# EAGLE design washing-machine (EAGLE 7.7.0)
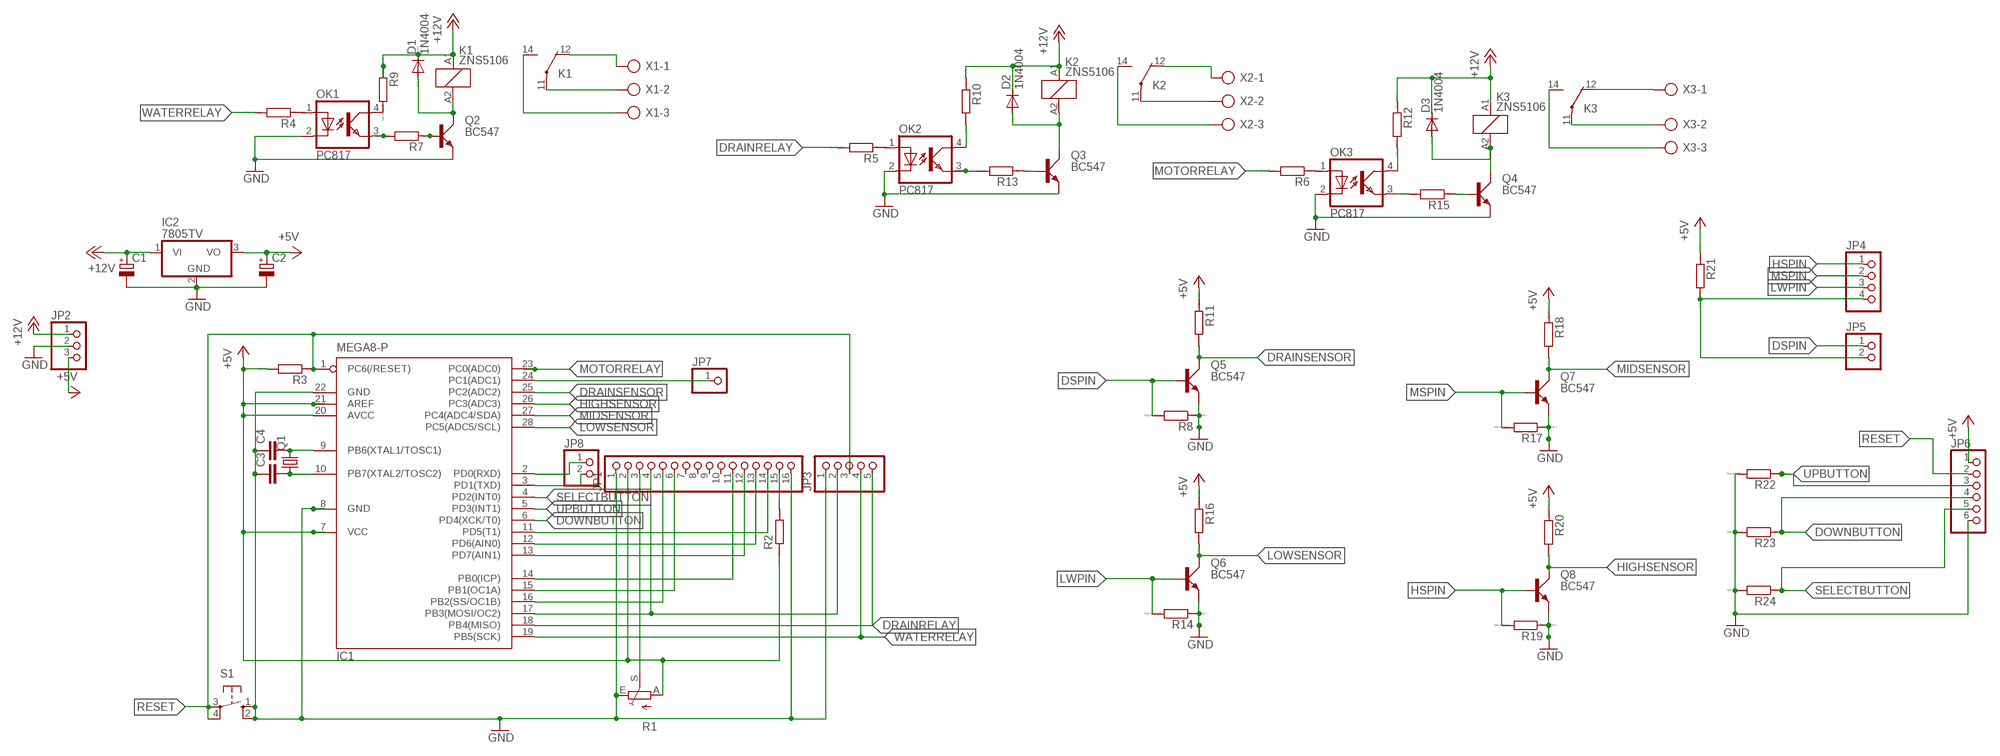
[diagram p0: schematic, sheet 1]

## Parts
C1  CPOL-EUE1.8-4  [E1,8-4]
C2  CPOL-EUE1.8-4  [E1,8-4]
C3  C-EU025-024X044  [C025-024X044]
C4  C-EU025-024X044  [C025-024X044]
D1  1N4004  [DO41-10]
D2  1N4004  [DO41-10]
D3  1N4004  [DO41-10]
IC1  MEGA8-P  [DIL28-3]
IC2  7805TV  [TO220V]
JP1  PINHD-1X16  [1X16]
JP2  PINHD-1X3  [1X03]
JP3  PINHD-1X5  [1X05]
JP4  PINHD-1X4  [1X04]
JP5  PINHD-1X2  [1X02]
JP6  PINHD-1X6  [1X06]
JP7  PINHD-1X1  [1X01]
JP8  PINHD-1X2  [1X02]
K1  ZNS5106  [ZN5]
K2  ZNS5106  [ZN5]
K3  ZNS5106  [ZN5]
OK1  PC817  [DIL04]
OK2  PC817  [DIL04]
OK3  PC817  [DIL04]
Q1  CRYSTALHC49S  [HC49/S]
Q2  BC547  [SOT54A]
Q3  BC547  [SOT54A]
Q4  BC547  [SOT54A]
Q5  BC547  [SOT54A]
Q6  BC547  [SOT54A]
Q7  BC547  [SOT54A]
Q8  BC547  [SOT54A]
R1  TRIM_EU-S63P  [S63P]
R2  R0204/7  [0204/7]
R3  R0204/7  [0204/7]
R4  R0204/7  [0204/7]
R5  R0204/7  [0204/7]
R6  R0204/7  [0204/7]
R7  R0204/7  [0204/7]
R8  R0204/7  [0204/7]
R9  R0204/7  [0204/7]
R10  R0204/7  [0204/7]
R11  R0204/7  [0204/7]
R12  R0204/7  [0204/7]
R13  R0204/7  [0204/7]
R14  R0204/7  [0204/7]
R15  R0204/7  [0204/7]
R16  R0204/7  [0204/7]
R17  R0204/7  [0204/7]
R18  R0204/7  [0204/7]
R19  R0204/7  [0204/7]
R20  R0204/7  [0204/7]
R21  R0204/7  [0204/7]
R22  R0204/7  [0204/7]
R23  R0204/7  [0204/7]
R24  R0204/7  [0204/7]
S1  10-XX  [B3F-10XX]
X1  AK500/3  [AK500/3]
X2  AK500/3  [AK500/3]
X3  AK500/3  [AK500/3]

## Nets
+5V: C2.+ IC1.7(VCC) IC1.20(AVCC) IC1.21(AREF) IC2.3(VO) JP1.2 JP2.3 JP6.1 R1.A R2.1 R3.2 R11.1 R16.1 R18.1 R20.1 R21.1
+12V: C1.+ D1.C D2.C D3.C IC2.1(VI) JP2.1 K1.A1 K2.A1 K3.A1 R9.1 R10.1 R12.1
DOWNBUTTON: IC1.6(PD4(XCK/T0)) JP6.4 R23.1
DRAINRELAY: IC1.18(PB4(MISO)) JP3.5 R5.2
DRAINSENSOR: IC1.25(PC2(ADC2)) Q5.C R11.2
DSPIN: JP5.1 Q5.B R8.2
GND: C1.- C2.- C3.1 C4.1 IC1.8(GND) IC1.22(GND) IC2.2(GND) JP1.1 JP1.16 JP2.2 JP3.1 JP6.6 OK1.2(C) OK2.2(C) OK3.2(C) Q2.E Q3.E Q4.E Q5.E Q6.E Q7.E Q8.E R1.E R8.1 R14.1 R17.1 R19.1 R22.2 R23.2 R24.2 S1.1(S) S1.2(S1)
HIGHSENSOR: IC1.26(PC3(ADC3)) Q8.C R20.2
HSPIN: JP4.1 Q8.B R19.2
LOWSENSOR: IC1.28(PC5(ADC5/SCL)) Q6.C R16.2
LWPIN: JP4.3 Q6.B R14.2
MIDSENSOR: IC1.27(PC4(ADC4/SDA)) Q7.C R18.2
MOTORRELAY: IC1.23(PC0(ADC0)) R6.2
MSPIN: JP4.2 Q7.B R17.2
N$1: IC1.13(PD7(AIN1)) JP1.12
N$2: IC1.11(PD5(T1)) JP1.14
N$3: IC1.12(PD6(AIN0)) JP1.13
N$4: IC1.17(PB3(MOSI/OC2)) JP1.4 JP3.2
N$5: IC1.16(PB2(SS/OC1B)) JP1.5
N$6: IC1.15(PB1(OC1A)) JP1.6
N$7: IC1.14(PB0(ICP)) JP1.11
N$8: C3.2 IC1.10(PB7(XTAL2/TOSC2)) Q1.1
N$9: C4.2 IC1.9(PB6(XTAL1/TOSC1)) Q1.2
N$10: OK1.1(A) R4.1
N$11: JP1.3 R1.S
N$12: OK1.3(EMIT) R7.2
N$13: Q2.B R7.1
N$14: OK2.4(COL) R10.2
N$15: D1.A K1.A2 Q2.C
N$16: D2.A K2.A2 Q3.C
N$17: OK1.4(COL) R9.2
N$18: OK2.3(EMIT) R13.2
N$19: Q3.B R13.1
N$20: OK3.4(COL) R12.2
N$21: OK3.3(EMIT) R15.2
N$22: Q4.B R15.1
N$23: D3.A K3.A2 Q4.C
N$24: K3.11(2:P) X3.2
N$25: K2.11(2:P) X2.2
N$26: K1.11(2:P) X1.2
N$27: K1.12(2:O) X1.1
N$28: JP1.15 R2.2
N$29: K1.14(2:S) X1.3
N$30: K2.12(2:O) X2.1
N$31: IC1.3(PD1(TXD)) JP8.2
N$32: OK2.1(A) R5.1
N$33: OK3.1(A) R6.1
N$34: K2.14(2:S) X2.3
N$35: K3.12(2:O) X3.1
N$36: K3.14(2:S) X3.3
N$37: JP4.4 JP5.2 R21.2
N$38: IC1.2(PD0(RXD)) JP8.1
N$39: IC1.24(PC1(ADC1)) JP7.1
RESET: IC1.1(PC6(/RESET)) JP3.3 JP6.2 R3.1 S1.3(P) S1.4(P1)
SELECTBUTTON: IC1.4(PD2(INT0)) JP6.5 R24.1
UPBUTTON: IC1.5(PD3(INT1)) JP6.3 R22.1
WATERRELAY: IC1.19(PB5(SCK)) JP3.4 R4.2
Unconnected: JP1.7 JP1.8 JP1.9 JP1.10

## Library data of the parts
C1 C2 = rcl:CPOL-EU: POLARIZED CAPACITOR, European symbol
C3 C4 = rcl:C-EU: CAPACITOR, European symbol
D1-D3 = diode:1N4004: DIODE general purpose rectifier, 1 A
IC1 = atmel:MEGA8-P: MICROCONTROLLER 8 Kbytes FLASH, 1 kbytes SRAM, 512 bytes EEPROM, USART, 4-channel 10 bit ADC, 2-channel 8 bit ADC Pin compatible with Atmega48, ATMega88, ATMega168 Source: avr.lbr; OC_FARNELL: unknown; OC_NEWARK: unknown
IC2 = linear:78*: Positive VOLTAGE REGULATOR Source: http://cache.national.com/ds/LM/LM78L05.pdf http://www.fairchildsemi.com/ds/LM/LM7805.pdf
JP1 = pinhead:PINHD-1X16: PIN HEADER
JP2 = pinhead:PINHD-1X3: PIN HEADER
JP3 = pinhead:PINHD-1X5: PIN HEADER
JP4 = pinhead:PINHD-1X4: PIN HEADER
JP5 JP8 = pinhead:PINHD-1X2: PIN HEADER
JP6 = pinhead:PINHD-1X6: PIN HEADER
JP7 = pinhead:PINHD-1X1: PIN HEADER
K1-K3 = relay:ZNS5*: Miniature Power PCB Relay SCHRACK 1pole 10 A Source: http://www.schrack.com/.. 5847.pdf; OC_FARNELL: unknown; OC_NEWARK: unknown
OK1-OK3 = optocoupler:PC817: SHARP OPTO COUPLER; MPN: PC817X4J000F; OC_FARNELL: 9707727; OC_NEWARK: 97K7059
Q1 = crystal:CRYSTAL: CRYSTAL; OC_FARNELL: 1667008; OC_NEWARK: unknown
Q2-Q8 = transistor-small-signal:BC547: NPN TRANSISTOR
R1 = pot:TRIM_EU-: POTENTIOMETER
R2-R24 = eagle-ltspice:R: RESISTOR, European symbol; SPICEMODEL: NONE; SPICEPREFIX: R
S1 = switch-omron:10-XX: OMRON SWITCH; MPN: B3F-1000; OC_FARNELL: 176432; OC_NEWARK: 36M3542
X1-X3 = con-ptr500:AK500/3: CONNECTOR; OC_FARNELL: unknown; OC_NEWARK: unknown

## Board
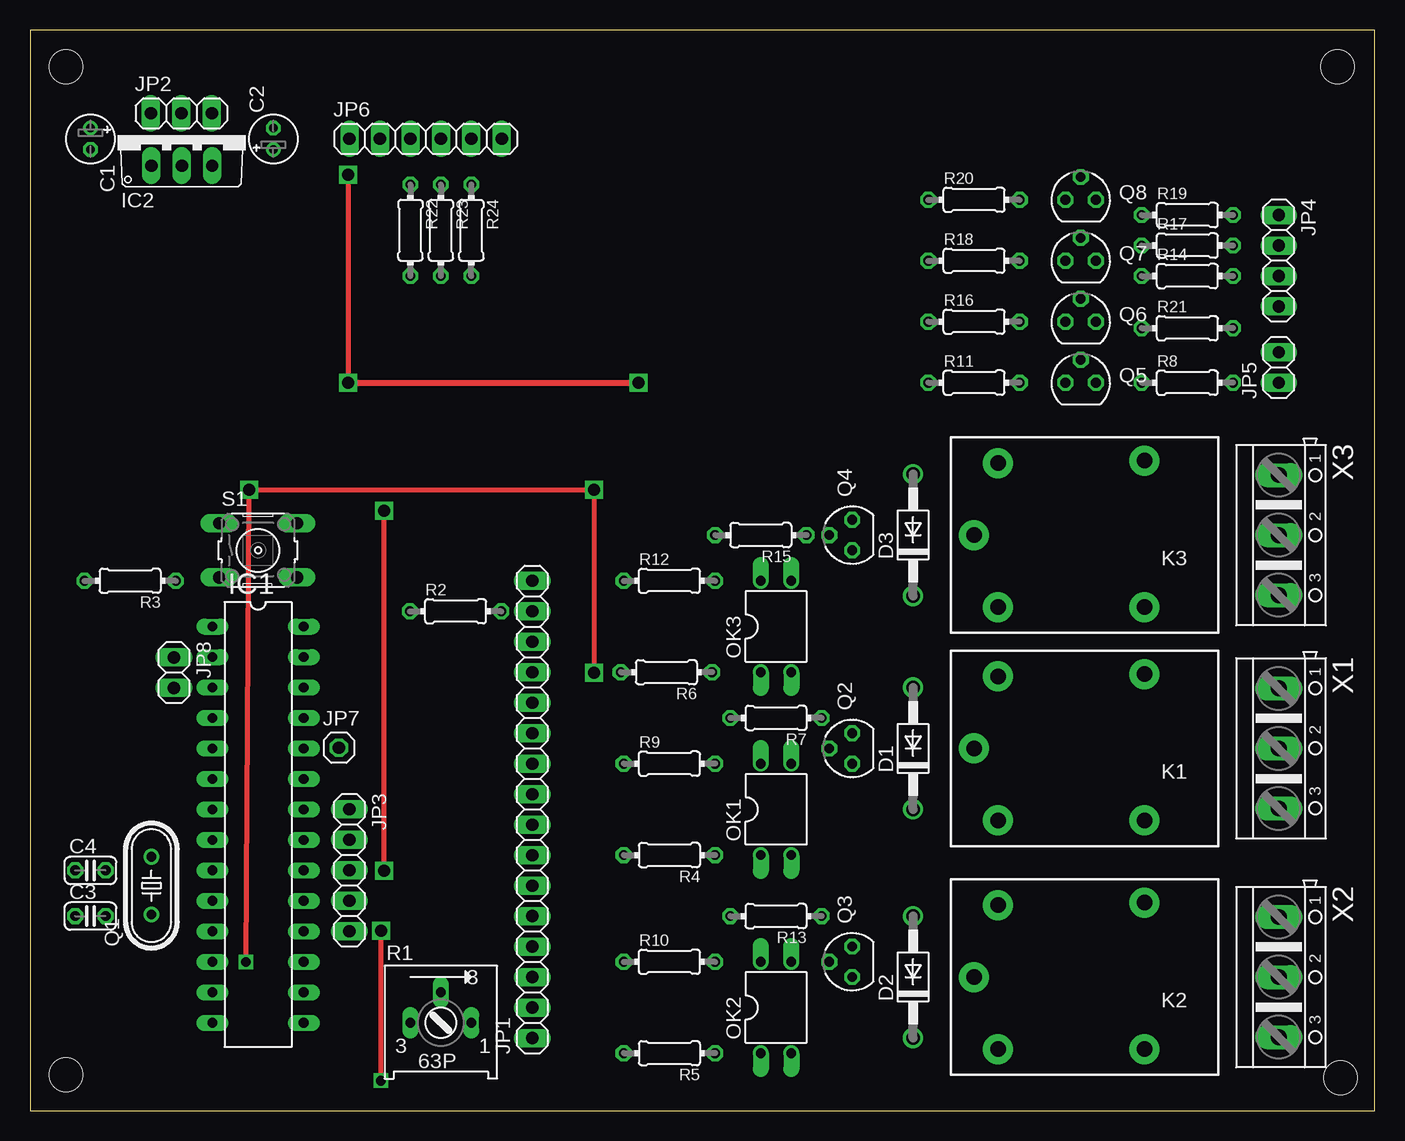
[diagram p1: board, top side]
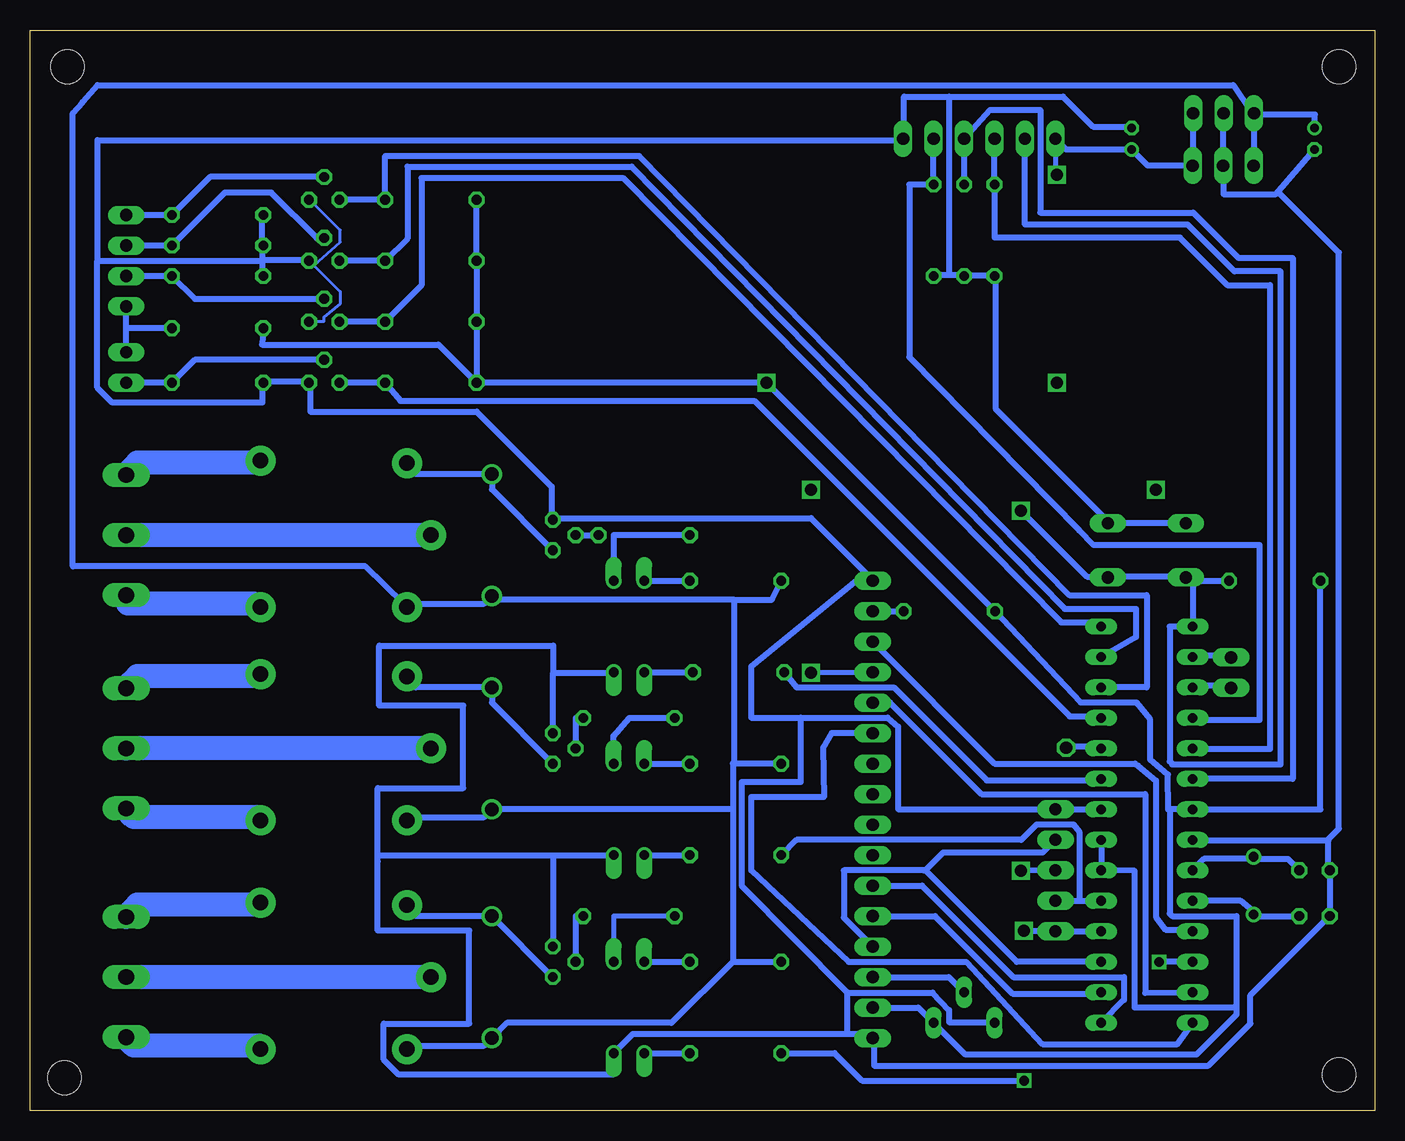
[diagram p2: board, bottom side, seen from below]

Size 112.12 x 90.06 mm. Coordinates in mm from the lower left corner, seen from the top.
Outline: 0,0 112.12,0 112.12,90.06 0,90.06 0,0
Copper layers (1*16): Top 0.035mm / dielectric 1.5mm / Bottom 0.035mm
Design rules "default": minimum track width 10mil, minimum drill 24mil, track to track 8mil, track to pad 8mil, pad to pad 8mil, via to via 8mil, smd to smd 8mil, copper to edge 40mil, drill to drill 8mil, minimum pad ring 10mil, minimum via ring 8mil, stop-mask expansion 4mil, vias tented up to drill 0mil, thermal gap 10mil
Holes 2.8 mm at 3,3 3,87 109,87 109.25,2.75

### Footprints (pad centres in the part's own frame; a part is rotated, then mirrored left to right if it is on the bottom)
E1,8-4 = drill 0.711 pad 1.168: + -0.889,0 | drill 0.711 pad 1.168 octagon: - 0.889,0
C025-024X044 = drill 0.813 octagon: 1 -1.27,0; 2 1.27,0
DO41-10 = drill 1.118: A 5.08,0; C -5.08,0
DIL28-3 = drill 0.813 long: 1 -16.51,-3.81; 2 -13.97,-3.81; 3 -11.43,-3.81; 4 -8.89,-3.81; 5 -6.35,-3.81; 6 -3.81,-3.81; 7 -1.27,-3.81; 8 1.27,-3.81; 9 3.81,-3.81; 10 6.35,-3.81; 11 8.89,-3.81; 12 11.43,-3.81; 13 13.97,-3.81; 14 16.51,-3.81; 15 16.51,3.81; 16 13.97,3.81; 17 11.43,3.81; 18 8.89,3.81; 19 6.35,3.81; 20 3.81,3.81; 21 1.27,3.81; 22 -1.27,3.81; 23 -3.81,3.81; 24 -6.35,3.81; 25 -8.89,3.81; 26 -11.43,3.81; 27 -13.97,3.81; 28 -16.51,3.81
TO220V = drill 1.016 long: 1 -2.54,-2.54; 2 0,-2.54; 3 2.54,-2.54
1X16 = drill 1.016 long: 1 -19.05,0; 2 -16.51,0; 3 -13.97,0; 4 -11.43,0; 5 -8.89,0; 6 -6.35,0; 7 -3.81,0; 8 -1.27,0; 9 1.27,0; 10 3.81,0; 11 6.35,0; 12 8.89,0; 13 11.43,0; 14 13.97,0; 15 16.51,0; 16 19.05,0
1X03 = drill 1.016 long: 1 -2.54,0; 2 0,0; 3 2.54,0
1X05 = drill 1.016 long: 1 -5.08,0; 2 -2.54,0; 3 0,0; 4 2.54,0; 5 5.08,0
1X04 = drill 1.016 long: 1 -3.81,0; 2 -1.27,0; 3 1.27,0; 4 3.81,0
1X02 = drill 1.016 long: 1 -1.27,0; 2 1.27,0
1X06 = drill 1.016 long: 1 -6.35,0; 2 -3.81,0; 3 -1.27,0; 4 1.27,0; 5 3.81,0; 6 6.35,0
1X01 = drill 1.016 octagon: 1 0,0
ZN5 = drill 1.3 pad 2.5: 11 8.89,0; 12 -5.31,-6.2; 14 -5.31,6; A1 6.89,6; A2 6.89,-6
DIL04 = drill 0.813 offset: 1 -1.27,-3.81; 2 1.27,-3.81; 3 1.27,3.81; 4 -1.27,3.81
HC49/S = drill 0.813: 1 -2.413,0; 2 2.413,0
SOT54A = drill 0.813 octagon: B 0,1.905; C -1.27,0; E 1.27,0
S63P = drill 0.813 long: A 2.54,0; E -2.54,0; S 0,2.54
0204/7 = drill 0.813 octagon: 1 -3.81,0; 2 3.81,0
B3F-10XX = drill 1.016 long: 1 -3.251,2.261; 2 3.251,2.261; 3 -3.251,-2.261; 4 3.251,-2.261
AK500/3 = drill 1.321 long: 1 -5.004,0; 2 0,0; 3 5.004,0

### Placement (x,y rotation side)
C1  5.04,80.99 270 top
C2  20.28,80.99 90 top
C3  5.04,16.22 0 top
C4  5.04,20.03 0 top
D1  73.62,30.19 90 top
D2  73.62,11.14 90 top
D3  73.62,47.97 90 top
IC1  19.01,23.84 270 top
IC2  12.66,81.3 0 top
JP1  41.87,25.11 90 top
JP2  12.62,83.12 0 top
JP3  26.63,20.03 270 top
JP4  104.1,70.83 270 top
JP5  104.1,61.94 90 top
JP6  32.98,80.99 0 top
JP7  25.75,30.25 0 top
JP8  12,36.5 270 top
K1  87.59,30.19 180 top
K2  87.59,11.14 180 top
K3  87.59,47.97 180 top
OK1  62.19,25.11 0 top
OK2  62.19,8.6 0 top
OK3  62.19,40.35 0 top
Q1  10.12,18.76 90 top
Q2  68.54,30.19 90 top
Q3  68.54,12.41 90 top
Q4  68.54,47.97 90 top
Q5  87.59,60.67 0 top
Q6  87.59,65.75 0 top
Q7  87.59,70.83 0 top
Q8  87.59,75.91 0 top
R1  34.25,7.33 0 top
R2  35.48,41.62 0 top
R3  8.35,44.16 180 top
R4  53.3,21.3 180 top
R5  53.3,4.79 180 top
R6  53.05,36.54 180 top
R7  62.19,32.73 180 top
R8  96.48,60.67 0 top
R9  53.3,28.92 0 top
R10  53.3,12.41 0 top
R11  78.7,60.67 0 top
R12  53.3,44.16 0 top
R13  62.19,16.22 180 top
R14  96.48,69.56 0 top
R15  60.92,47.97 180 top
R16  78.7,65.75 0 top
R17  96.48,72.1 0 top
R18  78.7,70.83 0 top
R19  96.48,74.64 0 top
R20  78.7,75.91 0 top
R21  96.48,65.21 0 top
R22  31.71,73.37 270 top
R23  34.25,73.37 270 top
R24  36.79,73.37 270 top
S1  19.01,46.7 0 top
X1  104.1,30.19 270 top
X2  104.1,11.14 270 top
X3  104.1,47.97 270 top

### Tracks (layer width: path | path; a pad name or v marks a point on that pad's centre or on a via)
+5V  (via drill 1)
  Top 0.406: v26.5,78 v26.5,60.67
  Top 0.5: v26.5,60.67 v50.72,60.67
  Bottom 0.406: JP6.1 26.63,78.12 v26.5,78 | JP2.3 15.2,83.12
  Bottom 0.5: R20.1 R18.1 R16.1 R11.1 | R11.1 78.06,63.84 92.78,63.84 R21.1 | JP1.2 38.06,8.6 R1.A 34.14,4.67 14.88,4.67 11.54,8.01 11.54,8.8 | IC1.21 IC1.20 20.03,19.99 20.03,8.6 11.75,8.6 11.54,8.8 | R3.2 4.54,25.11 IC1.7 17.11,25.11 | 17.11,25.11 17.24,25.11 17.25,28 18.74,29.26 18.74,32.62 19.87,34 24.52,34 R2.1 v50.72,60.67 R11.1 | 11.54,8.8 11.54,16.22 16.9,16.22 17.11,16.42 17.11,25.11 | 15.2,83.12 IC2.3 18.94,78.76 C2.+ 25.74,80.1 JP6.1
+12V
  Bottom 0.254: 80.61,24.48 K1.A1 | 50.33,42.57 50.26,42.64 | 10.27,83.17 JP2.1
  Bottom 0.406: 10.12,83.12 JP2.1 10.08,83 | C1.+ 5,81.88
  Bottom 0.5: 80.61,24.48 74.25,24.48 D1.C 53.53,25.11 | K2.A1 80.61,5.42 74.25,5.42 D2.C 72.35,7.33 58.65,7.33 53.53,12.41 | 53.53,12.41 R10.1 | 53.53,25.11 53.53,28.92 53.4,28.92 | 53.53,25.11 53.53,12.41 | R9.1 53.4,28.92 | 50.26,42.64 R12.1 | 53.4,42.57 50.33,42.57 | 53.4,28.92 53.4,42.57 | 53.4,42.57 73.3,42.57 D3.C 74.25,42.26 80.61,42.26 K3.A1 80.92,42.26 84.14,45.36 108.55,45.36 108.55,83.14 107.73,84.05 106.48,85.46 11.81,85.46 10.27,83.17 | 10.12,83.12 IC2.1 | 5,81.88 5,83 10.08,83
DOWNBUTTON
  Bottom 0.406: 15.2,27.66 IC1.6
  Bottom 0.5: R23.1 JP6.4 32.09,83.39 27.9,83.39 27.9,74.83 15.14,74.83 11.39,71.08 6.85,71.08 6.85,27.66 15.2,27.66
DRAINRELAY  (via drill 0.8, 1)
  Top 0.406: v29.25,2.5 v29.25,15
  Bottom 0.406: 29.2,14.95 v29.25,15
  Bottom 0.5: IC1.18 JP3.5 29.2,14.95 | R5.2 45.04,4.79 42.75,2.5 v29.25,2.5
DRAINSENSOR
  Bottom 0.5: IC1.25 23.2,32.86 25.45,32.86 51.73,59.15 81.24,59.15 R11.2 Q5.C
DSPIN
  Bottom 0.5: JP5.1 R8.2 98.39,62.58 Q5.B
GND
  Bottom 0.254: 12.79,83.17 JP2.2 | 12.62,78.75 IC2.2 | 3.75,16.25 C3.1 | 3.75,20 C4.1 | 8,76.5 8.25,76.38 | 3.88,22.62 3.88,22.5 | 22.25,49 S1.2 | 31.75,69.62 R22.2 31.62,69.5 | 34.25,69.62 R23.2 34.38,69.62 | 36.75,69.62 R24.2 | 39.25,81 JP6.6 39.38,80.88 | 63.5,36.5 OK3.2 | 68.5,31.5 Q2.E 68.5,31.38 | 63.5,21.25 OK1.2 | 41.88,6.12 JP1.1 | 92.75,70.88 92.75,70.85 | 92.75,69.62 R14.1 | 92.75,72 R17.1 92.75,72.12 | Q6.E 87.62,65.75 87.62,66.12 86.25,67.25 86.25,68.25 88.75,70.75 Q7.E | Q7.E 88.38,70.5 86.25,72.38 86.25,73.38 88.75,75.88 Q8.E 88.38,75.62 | 88.88,70.88 Q7.E | 26.62,25.12 JP3.1 26.75,25.12 | 68.62,49.25 Q4.E 68.5,49.38 | 92.62,60.75 R8.1 | 41.88,44.25 JP1.16 | 44,9.88 44,9.85 | 63.5,4.75 OK2.2
  Bottom 0.406: JP2.2 12.66,83.12 | 83.12,21.25 83.12,20.75
  Bottom 0.5: 12.62,78.75 12.62,76.38 8.25,76.38 5.12,80 C1.- | JP2.2 12.62,83 12.62,78.88 IC2.2 | 3.75,20 3.75,16.25 | IC1.8 15.12,22.5 3.88,22.5 3.88,20.12 C4.1 | 8,76.5 3,71.5 3,23.5 3.88,22.62 | 22.25,49 15.88,49 S1.1 | 34.25,69.62 31.75,69.62 | 34.38,69.62 35.5,69.62 | 35.5,69.62 36.75,69.62 | 35.5,84.5 39.25,84.5 39.25,81 | 35.5,84.5 26,84.5 23.5,82 20.38,82 C2.- | 35.5,84.5 35.5,69.62 | 31.62,69.5 31.62,58.5 22.25,49.12 S1.2 | 68.5,36.5 63.5,36.5 | 68.5,31.5 68.5,36.5 | 68.5,21.25 68.5,14 Q3.E 68.5,13.62 | 63.5,21.25 68.5,21.25 | R1.E 31.75,7.38 35.5,7.38 35.5,8.38 36.88,9.85 44,9.85 44,6.38 | OK2.2 61.88,6.38 44,6.38 | 44,6.38 42.5,6.38 JP1.1 41.75,6 41.75,3.75 13.88,3.75 10.38,7.25 10.38,9.62 3.88,16.12 C3.1 | 92.75,72 92.75,70.88 88.88,70.88 | 92.75,69.62 92.75,70.85 106.5,70.85 | 92.75,72.12 92.75,74.62 R19.1 | 26.62,25.12 22.88,25.12 IC1.22 | 68.62,49.25 68.62,52 74.88,58.25 88.75,58.25 88.75,60.62 Q5.E 88.88,60.75 92.62,60.75 | 41.88,44.25 47,49.38 68.5,49.38 | 26.75,25.12 39.75,25.12 39.75,32 40.62,32.75 47.88,32.75 | 47.88,32.75 52,32.75 52,37 42.5,44.75 JP1.16 | 106.5,70.85 106.5,60.25 105.25,59 92.75,59 92.75,60.62 R8.1 | 44,9.88 52.8,18.75 52.8,27.38 47.88,27.38 47.88,32.75 | 63.5,4.75 63.5,3 81.38,3 82.62,4.25 82.62,7.25 75.5,7.25 75.5,15 83.12,15 83.12,20.75 83.12,26.88 76,26.88 76,33.75 83,33.75 83,38.75 68.5,38.75 68.5,36.5 | 39.38,80.88 106.5,80.88 106.5,70.85 | 68.5,21.25 83.12,21.25
HIGHSENSOR
  Bottom 0.5: IC1.26 19.03,35.27 19.03,42.96 25.48,42.96 61.33,79.56 82.5,79.56 R20.2 Q8.C
HSPIN
  Bottom 0.5: JP4.1 R19.2 97.11,77.81 Q8.B
LOWSENSOR
  Bottom 0.5: IC1.28 22.91,40.69 26.15,40.69 62.69,77.73 79.49,77.73 79.49,68.77 R16.2 Q6.C
LWPIN
  Bottom 0.5: Q6.B 98.39,67.66 R14.2 JP4.3
MIDSENSOR
  Bottom 0.5: IC1.27 19.91,39.47 19.91,41.82 25.86,41.82 61.97,78.68 80.66,78.68 80.66,72.68 R18.2 Q7.C
MOTORRELAY
  Bottom 0.5: IC1.23 22.95,27.54 32.36,27.54 40.1,35.27 48.22,35.27 R6.2
MSPIN
  Bottom 0.5: JP4.2 R17.2 95.89,76.5 92,76.5 88.23,72.73 Q7.B
N$1
  Bottom 0.5: IC1.13 19.14,9.82 19.14,26.38 32.8,26.38 40.42,34 JP1.12
N$2
  Bottom 0.5: IC1.11 15.34,15.09 17.47,15.09 18.26,16.12 18.25,27.5 19.76,28.76 20.01,28.92 31.71,28.92 JP1.14
N$3  (via drill 0.8, 1)
  Top 0.406: v18,12.41 v18.25,51.75 v47,51.75 v47,36.5
  Bottom 0.406: v47,36.5 46.96,36.54 JP1.13
  Bottom 0.5: IC1.12 v18,12.41
N$4
  Bottom 0.254: 37.6,20 37.6,20.03
  Bottom 0.5: JP1.4 44.27,16.09 44.27,20.03 37.6,20.03 37.47,20.03 | JP3.2 27.7,21.5 36,21.5 37.47,20.03 | IC1.17 29.85,12.41 37.47,20.03
N$5
  Bottom 0.5: IC1.16 23.2,9.75 30.21,9.75 36.67,16.22 JP1.5
N$6
  Bottom 0.5: IC1.15 20.91,9.23 20.91,11.14 30.14,11.14 37.76,18.76 JP1.6
N$7
  Bottom 0.5: IC1.14 16.47,5.56 27.72,5.56 34.07,12.41 43.89,12.41 52.01,20.03 52.01,26.13 45.95,26.13 46,30.25 45.29,31.46 JP1.11
N$8
  Bottom 0.254: 10.12,16.22 Q1.1
  Bottom 0.5: 10.12,16.22 C3.2 | IC1.10 11.2,17.49 10.44,16.86 10.12,16.54 Q1.1
N$9
  Bottom 0.5: C4.2 7.26,20.98 10.12,20.98 | IC1.9 14.25,20.98 10.12,20.98 | 10.12,20.98 Q1.2
N$10
  Bottom 0.5: OK1.1 R4.1
N$11
  Bottom 0.5: R1.S 35.52,11.14 JP1.3
N$12
  Bottom 0.254: OK1.3 63.46,29.24
  Bottom 0.5: R7.2 62.15,32.73 63.49,31.21 63.46,29.24
N$13
  Bottom 0.5: Q2.B 66.64,32.73 R7.1
N$14
  Bottom 0.5: OK2.4 R10.2
N$15
  Bottom 0.5: Q2.C 73.62,34 D1.A 79.97,35.27 80.61,35.91 K1.A2
N$16
  Bottom 0.5: Q3.C D2.A 79.97,16.22 80.61,16.86 K2.A2
N$17
  Bottom 0.5: OK1.4 R9.2
N$18
  Bottom 0.406: R13.2 63.46,16.22 OK2.3
N$19
  Bottom 0.406: R13.1 66.64,16.22
  Bottom 0.5: 66.64,16.22 Q3.B
N$20
  Bottom 0.5: OK3.4 R12.2
N$21
  Bottom 0.5: OK3.3 63.46,47.97 R15.2
N$22
  Bottom 0.5: Q4.B R15.1
N$23
  Bottom 0.5: Q4.C 73.62,51.78 D3.A 79.97,53.05 80.61,53.69 K3.A2
N$24
  Bottom 2: K3.11 X3.2
N$25
  Bottom 2: K2.11 X2.2
N$26
  Bottom 2: K1.11 X1.2
N$27
  Bottom 0.254: 104.1,35.27 X1.1 | 92.99,36.22 K1.12
  Bottom 2: 104.1,35.27 103.15,36.22 92.99,36.22
N$28
  Bottom 0.5: JP1.15 R2.2
N$29
  Bottom 2: X1.3 104.1,25.11 103.47,24.48 92.99,24.48 K1.14
N$30
  Bottom 0.254: 92.99,17.17 K2.12
  Bottom 2: 92.99,17.17 103.15,17.17 104.1,16.22 X2.1
N$31
  Bottom 0.5: IC1.3 15.07,35.4 12.1,35.4 JP8.2
N$32
  Bottom 0.5: OK2.1 R5.1
N$33
  Bottom 0.5: OK3.1 R6.1
N$34
  Bottom 0.254: 92.99,5.42 K2.14
  Bottom 2: 92.99,5.42 103.47,5.42 104.1,6.06 X2.3
N$35
  Bottom 0.254: 104.1,53.05 X3.1
  Bottom 2: 104.1,53.05 103.15,54 92.99,54 K3.12
N$36
  Bottom 2: X3.3 104.1,42.89 103.97,42.26 93.49,42.26 K3.14
N$37
  Bottom 0.5: JP5.2 104.1,65.21 | 104.1,65.21 JP4.4 | R21.2 104.1,65.21
N$38
  Bottom 0.5: IC1.2 15.07,37.91 12.1,37.91 JP8.1
N$39
  Bottom 0.5: IC1.24 22.84,30.37 25.82,30.37 JP7.1
RESET  (via drill 1)
  Top 0.406: v29.5,20 v29.5,50
  Bottom 0.254: 15.52,44.16 15.2,44.16 S1.3 15.84,44.48 | 22.18,44.48 S1.4
  Bottom 0.406: 23,44.5 22.94,44.44 | 16.9,28.84 16.9,28.92
  Bottom 0.5: R3.1 15.2,44.16 IC1.1 17.11,40.35 17.11,29.12 16.9,28.92 | 15.52,44.16 S1.3 | 15.84,44.48 22.18,44.48 | JP6.2 29.17,73.84 15.61,73.84 11.71,69.94 7.87,69.94 7.87,28.84 16.9,28.84 | v29.5,50 24,44.5 23,44.5 | 22.94,44.44 S1.4 | JP3.3 v29.5,20
SELECTBUTTON
  Bottom 0.406: 15.2,32.54 IC1.4
  Bottom 0.5: JP6.5 R24.1 38.81,77.18 38.81,62.79 24.66,48.35 23.45,47.15 9.64,47.15 9.64,32.54 15.2,32.54
UPBUTTON
  Bottom 0.406: 15.2,30.14 IC1.5
  Bottom 0.5: JP6.3 R22.1 31.71,72.75 16.25,72.75 12.31,68.81 8.75,68.81 8.75,30.14 15.2,30.14
WATERRELAY
  Bottom 0.5: JP3.4 24.6,17.49 | 24.6,17.49 IC1.19 | R4.2 48.22,22.57 29.49,22.57 28.22,23.84 25.11,23.84 24.6,23.2 24.6,17.49